# EasyEDA schematic Shield_Amir_EDO_V_0_2.json
TITLE: For EDO (DROP SCREEN exhibit, 3D exhebition); REV: 0.1; Date: 2023-12-05; Sheet: 1/1; Company: Amir BS
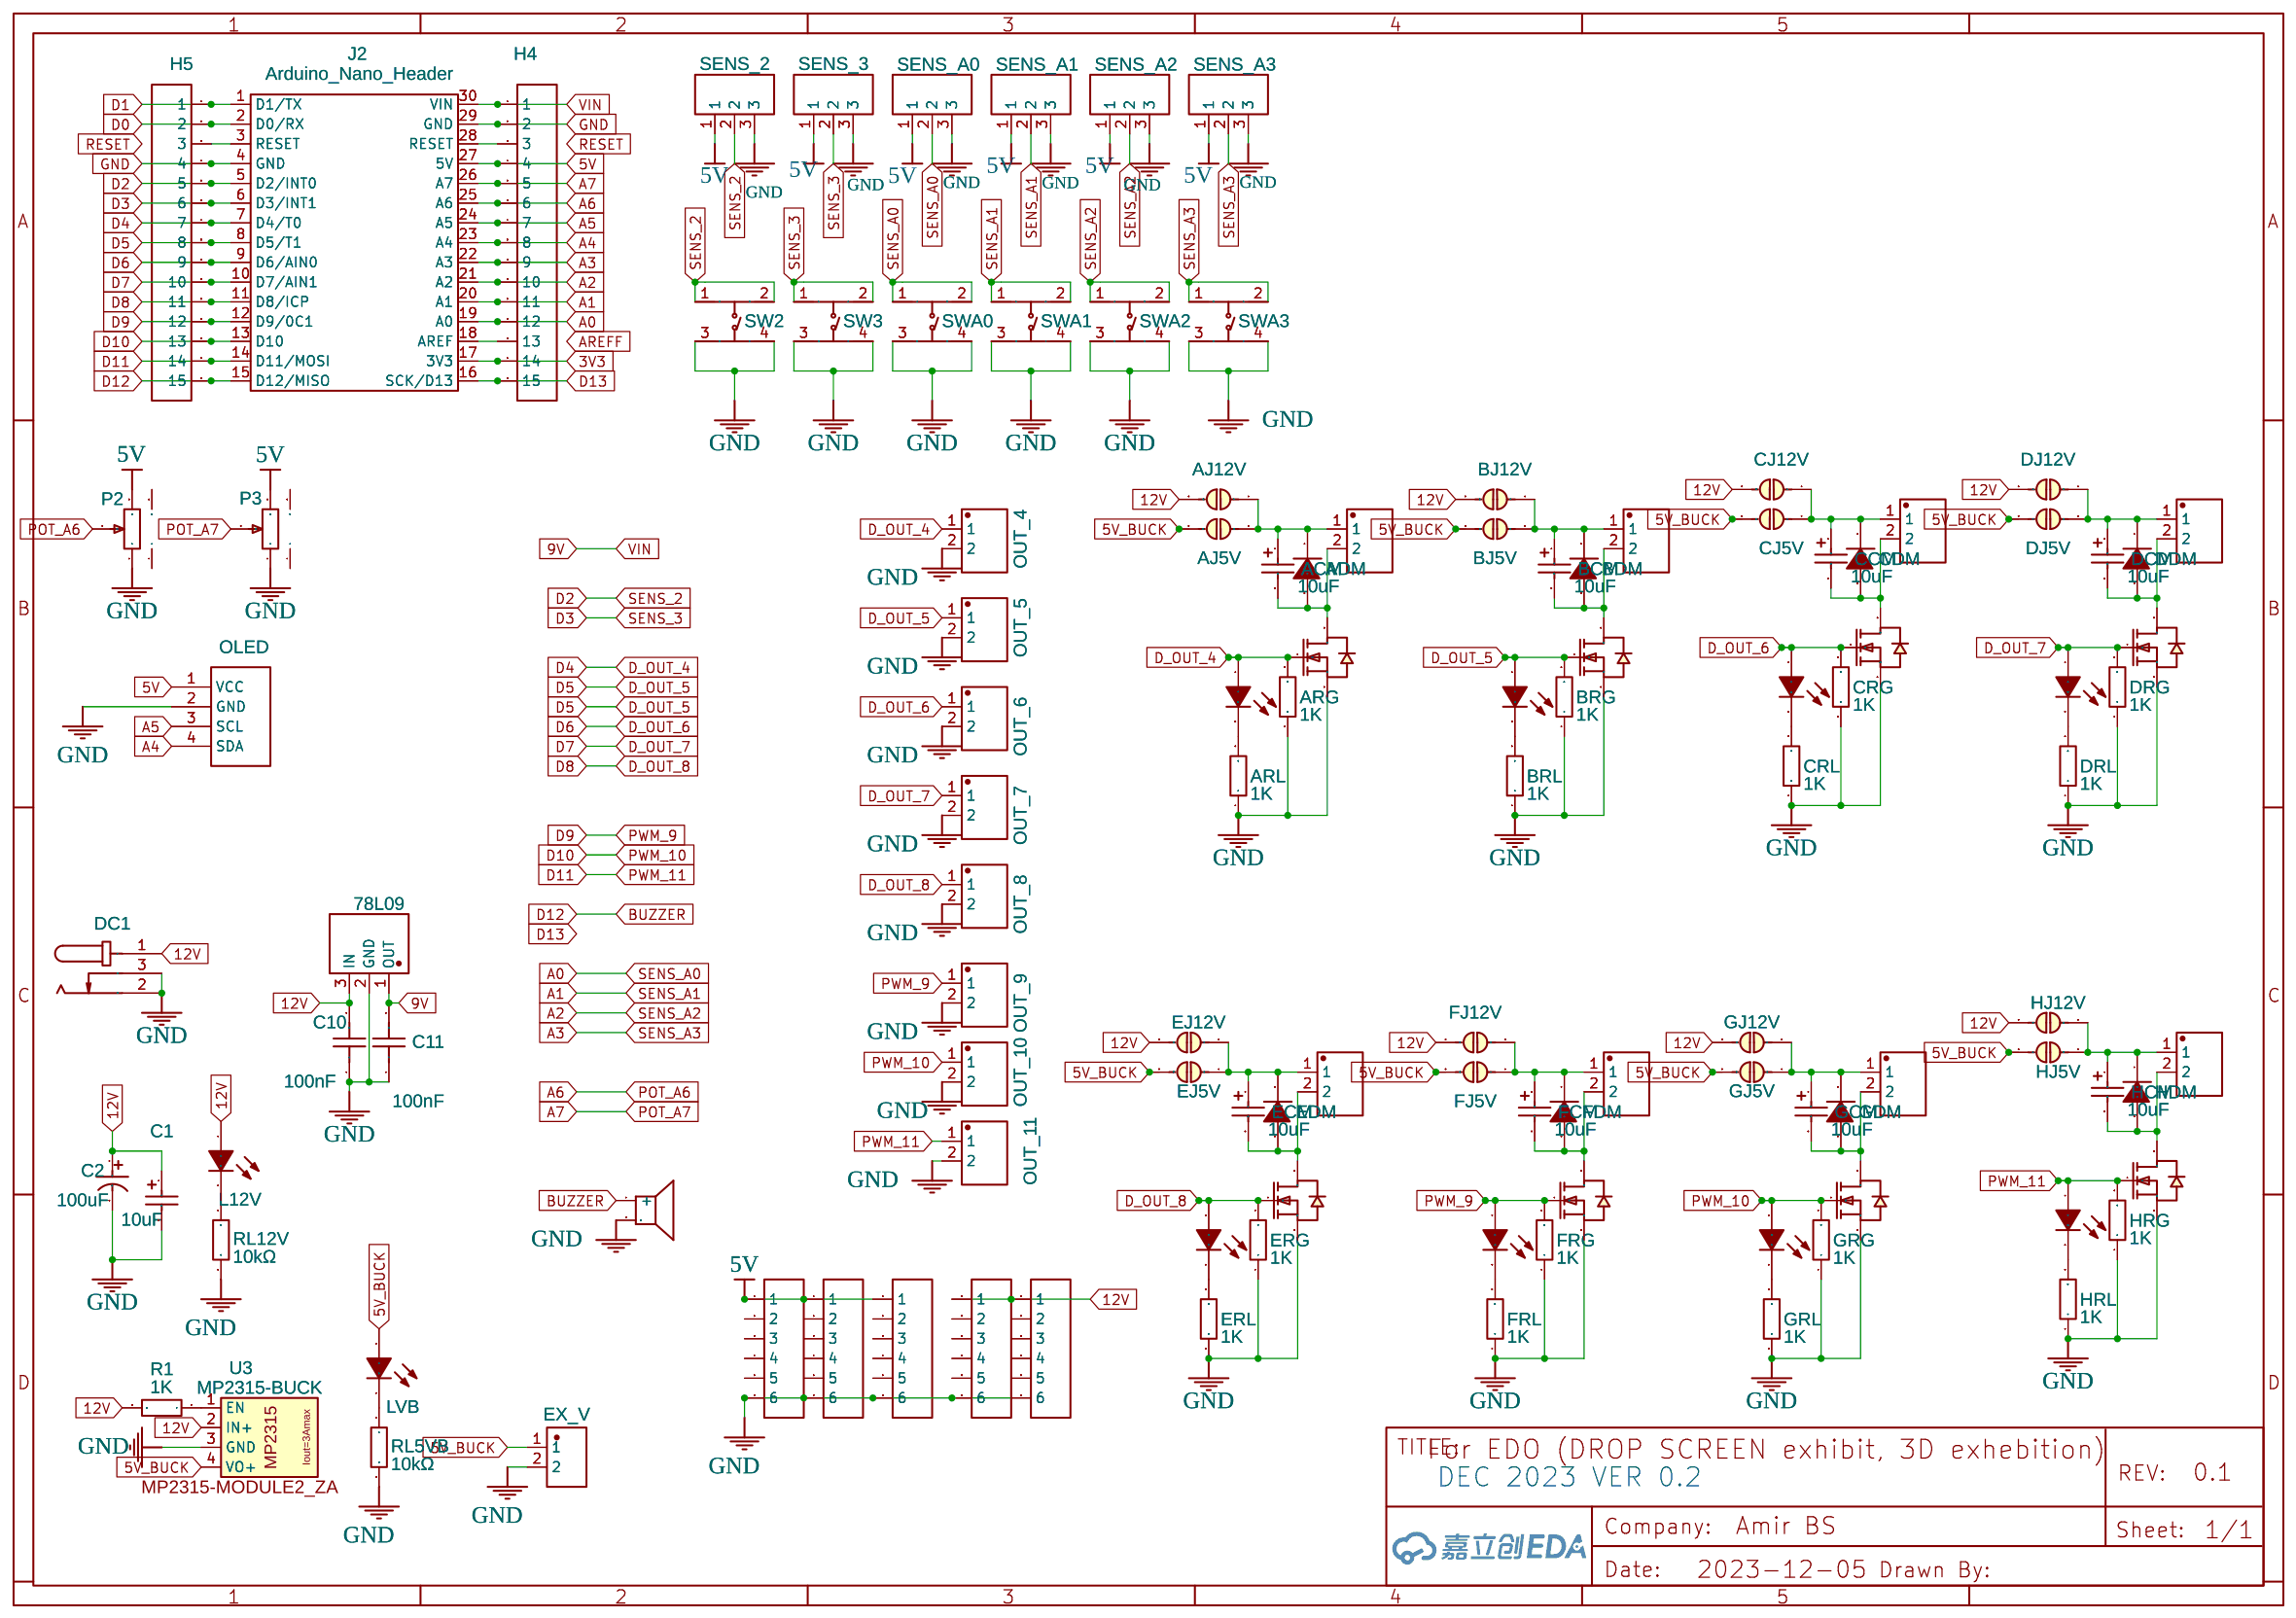
[diagram p0: schematic sheet]

## Parts
ACM  10uF  [CAP-SMD_L3.2-W1.6-RD-C7171]
ACON  KF2510-2A  [CONN-TH_KF2510-2A]
ADM  1N4007  [SMAF_L3.5-W2.6-LS4.7-RD]
AJ5V  JUMPER-SMT_2  [JUMPERS_SMT-JUMPER_2_NC_PASTE_NO-SILK]
AJ12V  JUMPER-SMT_2  [JUMPERS_SMT-JUMPER_2_NC_PASTE_NO-SILK]
ALD  LED  [LED0603-R-RD_BLUE]
AQ  Q  [SOT-23-3_L2.9-W1.3-P0.95-LS2.4-BR]
ARG  1K  [R0603]
ARL  1K  [R0603]
BCM  10uF  [CAP-SMD_L3.2-W1.6-RD-C7171]
BCON  KF2510-2A  [CONN-TH_KF2510-2A]
BDM  1N4007  [SMAF_L3.5-W2.6-LS4.7-RD]
BJ5V  JUMPER-SMT_2  [JUMPERS_SMT-JUMPER_2_NC_PASTE_NO-SILK]
BJ12V  JUMPER-SMT_2  [JUMPERS_SMT-JUMPER_2_NC_PASTE_NO-SILK]
BLD  LED  [LED0603-R-RD_BLUE]
BQ  Q  [SOT-23-3_L2.9-W1.3-P0.95-LS2.4-BR]
BRG  1K  [R0603]
BRL  1K  [R0603]
BUZZER1  BUZZER-12X9  [BUZ-TH_BD12.0-P7.60-D0.6-FD]
C1  10uF  [CAP-SMD_L3.2-W1.6-RD-C7171]
C2  100uF  [CAP-TH_BD6.3-P2.50-D1.0-FD]
C10  100nF  [C0603]
C11  100nF  [C0603]
CCM  10uF  [CAP-SMD_L3.2-W1.6-RD-C7171]
CCON  KF2510-2A  [CONN-TH_KF2510-2A]
CDM  1N4007  [SMAF_L3.5-W2.6-LS4.7-RD]
CJ5V  JUMPER-SMT_2  [JUMPERS_SMT-JUMPER_2_NC_PASTE_NO-SILK]
CJ12V  JUMPER-SMT_2  [JUMPERS_SMT-JUMPER_2_NC_PASTE_NO-SILK]
CLD  LED  [LED0603-R-RD_BLUE]
CQ  Q  [SOT-23-3_L2.9-W1.3-P0.95-LS2.4-BR]
CRG  1K  [R0603]
CRL  1K  [R0603]
DC1  DC  [DC-IN-TH_DC005]
DCM  10uF  [CAP-SMD_L3.2-W1.6-RD-C7171]
DCON  KF2510-2A  [CONN-TH_KF2510-2A]
DDM  1N4007  [SMAF_L3.5-W2.6-LS4.7-RD]
DJ5V  JUMPER-SMT_2  [JUMPERS_SMT-JUMPER_2_NC_PASTE_NO-SILK]
DJ12V  JUMPER-SMT_2  [JUMPERS_SMT-JUMPER_2_NC_PASTE_NO-SILK]
DLD  LED  [LED0603-R-RD_BLUE]
DQ  Q  [SOT-23-3_L2.9-W1.3-P0.95-LS2.4-BR]
DRG  1K  [R0603]
DRL  1K  [R0603]
ECM  10uF  [CAP-SMD_L3.2-W1.6-RD-C7171]
ECON  KF2510-2A  [CONN-TH_KF2510-2A]
EDM  1N4007  [SMAF_L3.5-W2.6-LS4.7-RD]
EJ5V  JUMPER-SMT_2  [JUMPERS_SMT-JUMPER_2_NC_PASTE_NO-SILK]
EJ12V  JUMPER-SMT_2  [JUMPERS_SMT-JUMPER_2_NC_PASTE_NO-SILK]
ELD  LED  [LED0603-R-RD_BLUE]
EQ  Q  [SOT-23-3_L2.9-W1.3-P0.95-LS2.4-BR]
ERG  1K  [R0603]
ERL  1K  [R0603]
EX_V  EX_V  [CONN-TH_2P-P5.00_L7.6-W10.0]
FCM  10uF  [CAP-SMD_L3.2-W1.6-RD-C7171]
FCON  KF2510-2A  [CONN-TH_KF2510-2A]
FDM  1N4007  [SMAF_L3.5-W2.6-LS4.7-RD]
FJ5V  JUMPER-SMT_2  [JUMPERS_SMT-JUMPER_2_NC_PASTE_NO-SILK]
FJ12V  JUMPER-SMT_2  [JUMPERS_SMT-JUMPER_2_NC_PASTE_NO-SILK]
FLD  LED  [LED0603-R-RD_BLUE]
FQ  Q  [SOT-23-3_L2.9-W1.3-P0.95-LS2.4-BR]
FRG  1K  [R0603]
FRL  1K  [R0603]
GCM  10uF  [CAP-SMD_L3.2-W1.6-RD-C7171]
GCON  KF2510-2A  [CONN-TH_KF2510-2A]
GDM  1N4007  [SMAF_L3.5-W2.6-LS4.7-RD]
GJ5V  JUMPER-SMT_2  [JUMPERS_SMT-JUMPER_2_NC_PASTE_NO-SILK]
GJ12V  JUMPER-SMT_2  [JUMPERS_SMT-JUMPER_2_NC_PASTE_NO-SILK]
GLD  LED  [LED0603-R-RD_BLUE]
GQ  Q  [SOT-23-3_L2.9-W1.3-P0.95-LS2.4-BR]
GRG  1K  [R0603]
GRL  1K  [R0603]
H1  HDR-F-2.54_1x6  [HDR-F-2.54_1X6]
H2  HDR-F-2.54_1x6  [HDR-F-2.54_1X6]
H3  HDR-F-2.54_1x6  [HDR-F-2.54_1X6]
H4  HDR-F-2.54_1x15  [HDR-F-2.54_1X15]
H5  HDR-F-2.54_1x15  [HDR-F-2.54_1X15]
H6  HDR-F-2.54_1x6  [HDR-F-2.54_1X6]
H11  HDR-F-2.54_1x6  [HDR-F-2.54_1X6]
HCM  10uF  [CAP-SMD_L3.2-W1.6-RD-C7171]
HCON  KF2510-2A  [CONN-TH_KF2510-2A]
HDM  1N4007  [SMAF_L3.5-W2.6-LS4.7-RD]
HJ5V  JUMPER-SMT_2  [JUMPERS_SMT-JUMPER_2_NC_PASTE_NO-SILK]
HJ12V  JUMPER-SMT_2  [JUMPERS_SMT-JUMPER_2_NC_PASTE_NO-SILK]
HLD  LED  [LED0603-R-RD_BLUE]
HQ  Q  [SOT-23-3_L2.9-W1.3-P0.95-LS2.4-BR]
HRG  1K  [R0603]
HRL  1K  [R0603]
J2  Arduino_Nano_Header  [DIP-30_L43.18-W15.24-ARDUINONANO]
L12V  LED  [LED0603-R-RD_BLUE]
LVB  LED  [LED0603-R-RD_BLUE]
OLED  1.3 inch OLED SSH1106 I2C 128x64 copy  [1.3_OLED_SSH1106_I2C_128X64_BOARD]
OUT_4  KF2510-2A  [CONN-TH_KF2510-2A]
OUT_5  KF2510-2A  [CONN-TH_KF2510-2A]
OUT_6  KF2510-2A  [CONN-TH_KF2510-2A]
OUT_7  KF2510-2A  [CONN-TH_KF2510-2A]
OUT_8  KF2510-2A  [CONN-TH_KF2510-2A]
OUT_9  KF2510-2A  [CONN-TH_KF2510-2A]
OUT_10  KF2510-2A  [CONN-TH_KF2510-2A]
OUT_11  KF2510-2A  [CONN-TH_KF2510-2A]
P2  长柄旋转电位器  [RES-ADJ-TH_RV09]
P3  长柄旋转电位器  [RES-ADJ-TH_RV09]
R1  1K  [R0603]
RL5VB  10kΩ  [R0603]
RL12V  10kΩ  [R0603]
SENS_2  FK2510  [CONN-TH_3P-P2.00_KF2510_3A]
SENS_3  FK2510  [CONN-TH_3P-P2.00_KF2510_3A]
SENS_A0  FK2510  [CONN-TH_3P-P2.00_KF2510_3A]
SENS_A1  FK2510  [CONN-TH_3P-P2.00_KF2510_3A]
SENS_A2  FK2510  [CONN-TH_3P-P2.00_KF2510_3A]
SENS_A3  FK2510  [CONN-TH_3P-P2.00_KF2510_3A]
SW2  TC-6610-7-160G  [SW-TH_4P-L5.0-W5.0-P4.50-LS6.5]
SW3  TC-6610-7-160G  [SW-TH_4P-L5.0-W5.0-P4.50-LS6.5]
SWA0  TC-6610-7-160G  [SW-TH_4P-L5.0-W5.0-P4.50-LS6.5]
SWA1  TC-6610-7-160G  [SW-TH_4P-L5.0-W5.0-P4.50-LS6.5]
SWA2  TC-6610-7-160G  [SW-TH_4P-L5.0-W5.0-P4.50-LS6.5]
SWA3  TC-6610-7-160G  [SW-TH_4P-L5.0-W5.0-P4.50-LS6.5]
U3  MP2315-BUCK  [MP2315-MODULE2_ZA]
U5  78L09  [SOT-89-3_L4.5-W2.5-P1.50-LS4.0-BR]

## Library data of the parts
ACM BCM CCM DCM ECM FCM GCM HCM = TAJA106K016RNJ: JLCPCB Part Class: Basic Part; Package Display: No
ACON BCON CCON DCON ECON FCON GCON HCON OUT_4-OUT_11 = KF2510-2A: Supplier: LCSC; Manufacturer: BOOMELE; Supplier Part: C27543; JLCPCB Part Class: Extended Part; Package Display: No
ADM BDM CDM DDM EDM FDM GDM HDM = 1N4007F: Supplier: LCSC; Manufacturer: SK; Supplier Part: C110856; JLCPCB Part Class: Extended Part; Package Display: No
AJ5V AJ12V BJ5V BJ12V CJ5V CJ12V DJ5V DJ12V EJ5V EJ12V FJ5V FJ12V GJ5V GJ12V HJ5V HJ12V = JUMPER-SMT_2: Contributor: P-Thomsen; Package Display: No
ALD BLD CLD DLD ELD FLD GLD HLD L12V LVB = 19-217/BHC-ZL1M2RY/3T: Supplier: LCSC; Manufacturer: EVERLIGHT; Supplier Part: C72041; JLCPCB Part Class: Basic Part; Package Display: No
AQ BQ CQ DQ EQ FQ GQ HQ = JSM2302: Supplier: LCSC; Supplier Part: C5224189; Manufacturer: ElecSuper(静芯微）; Manufacturer Part: AO3400; Contributor: LCSC; JLCPCB Part Class: Extended Part; Package Display: No
ARG ARL BRG BRL CRG CRL DRG DRL ERG ERL FRG FRL GRG GRL HRG HRL R1 = 0603WAF1001T5E: Supplier: LCSC; Manufacturer: UniOhm; Supplier Part: C21190; JLCPCB Part Class: Basic Part; Package Display: No
BUZZER1 = BUZZER-12X9: Contributor: lcsc; Supplier: LCSC; Supplier Part: C9900016920; Manufacturer: null; JLCPCB Part Class: Extended Part; Package Display: No
C1 = TAJA106K016RNJ: Supplier: LCSC; Manufacturer: Kyocera AVX; Supplier Part: C7171; JLCPCB Part Class: Basic Part; Package Display: No
C2 = 100uF 35V 6.3*11: Supplier: LCSC; Manufacturer: CX(承兴); Supplier Part: C19504; JLCPCB Part Class: Extended Part; Package Display: No
C10 C11 = CC0603KRX7R9BB104: JLCPCB Part Class: Basic Part; Package Display: No
DC1 = DC005-2.0MM: Supplier: LCSC; Manufacturer: SOFNG; Supplier Part: C111567; Package Display: No
EX_V = WJ306V-5.0-2P-14-00A: Contributor: lcsc; Supplier: LCSC; Supplier Part: C3031443; Manufacturer: KANGNEX(康奈克斯电气); JLCPCB Part Class: Extended Part; Package Display: No
H1-H3 H6 H11 = HDR-F-2.54_1x6: Supplier Part: C40877; Supplier: LCSC; Contributor: LCEDA_Lib; Package Display: No
H4 H5 = HDR-F-2.54_1x15: Supplier Part: C124408; Supplier: LCSC; Contributor: LCEDA_Lib; Package Display: No
J2 = Arduino_Nano_Header
OLED = 1.3 inch OLED SSH1106 I2C 128x64 copy: Contributor: Deguello; Package Display: No
P2 P3 = 长柄旋转电位器: Supplier: LCSC; Supplier Part: C2874842; Manufacturer: null; JLCPCB Part Class: Extended Part; Contributor: LCSC; Package Display: No
RL5VB RL12V = 0603WAF1002T5E: Supplier: LCSC; Manufacturer: UNI-ROYAL(厚声); Supplier Part: C25804; Resistance (Ohms): 10K; JLCPCB Part Class: Basic Part; Package Display: No
SENS_2 SENS_3 SENS_A0-SENS_A3 = kf2510_3A: JLCPCB Part Class: Extended Part; Package Display: No
SW2 SW3 SWA0-SWA3 = TC-6610-7-160G: Contributor: LCSC; Supplier: LCSC; Supplier Part: C2845252; Manufacturer: HCTL(华灿天禄); JLCPCB Part Class: Extended Part; Package Display: No
U3 = MP2315-BUCK: Supplier: FatimaTech; Contributor: zainul.aabdin; Package Display: Yes
U5 = 78L09U 78L09: Contributor: LCSC; Supplier: LCSC; Supplier Part: C2875177; Manufacturer: CBI(创基); JLCPCB Part Class: Extended Part; Package Display: No

## Nets
3V3: H4.14 J2.17(3V3)
5V: H1.1 H2.1 H3.1 H4.4 J2.27(5V) OLED.1(VCC) P2.3 P3.3 SENS_2.1 SENS_3.1 SENS_A0.1 SENS_A1.1 SENS_A2.1 SENS_A3.1
5V_BUCK: AJ5V.2 BJ5V.2 CJ5V.2 DJ5V.2 EJ5V.2 EX_V.1 FJ5V.2 GJ5V.2 HJ5V.2 LVB.1(A) U3.4(VO+)
9V: C11.2 H4.1 J2.30(VIN) U5.1(OUT)
12V: AJ12V.2 BJ12V.2 C1.1 C2.1 C10.2 CJ12V.2 DC1.1 DJ12V.2 EJ12V.2 FJ12V.2 GJ12V.2 H6.1 H11.1 HJ12V.2 L12V.1(A) R1.2 U3.2(IN+) U5.3(IN)
GND: AQ.2(S) ARG.1 ARL.1 BQ.2(S) BRG.1 BRL.1 BUZZER1.2 C1.2 C2.2 C10.1 C11.1 CQ.2(S) CRG.1 CRL.1 DC1.2 DC1.3 DQ.2(S) DRG.1 DRL.1 EQ.2(S) ERG.1 ERL.1 EX_V.2 FQ.2(S) FRG.1 FRL.1 GQ.2(S) GRG.1 GRL.1 H1.6 H2.6 H3.6 H4.2 H5.4 H6.6 H11.6 HQ.2(S) HRG.1 HRL.1 J2.4(GND) J2.29(GND) OLED.2(GND) OUT_4.2 OUT_5.2 OUT_6.2 OUT_7.2 OUT_8.2 OUT_9.2 OUT_10.2 OUT_11.2 P2.1 P3.1 RL5VB.2 RL12V.2 SENS_2.3 SENS_3.3 SENS_A0.3 SENS_A1.3 SENS_A2.3 SENS_A3.3 SW2.3 SW2.4 SW3.3 SW3.4 SWA0.3 SWA0.4 SWA1.3 SWA1.4 SWA2.3 SWA2.4 SWA3.3 SWA3.4 U3.3(GND) U5.2(GND)
A0: H4.12 J2.19(A0) SENS_A0.2 SWA0.1 SWA0.2
A1: H4.11 J2.20(A1) SENS_A1.2 SWA1.1 SWA1.2
A2: H4.10 J2.21(A2) SENS_A2.2 SWA2.1 SWA2.2
A3: H4.9 J2.22(A3) SENS_A3.2 SWA3.1 SWA3.2
A4: H4.8 J2.23(A4) OLED.4(SDA)
A5: H4.7 J2.24(A5) OLED.3(SCL)
A6: H4.6 J2.25(A6) P2.2
A7: H4.5 J2.26(A7) P3.2
BUZZER: BUZZER1.1(+) H5.15 J2.15(D12/MISO)
D0: H5.2 J2.2(D0/RX)
D1: H5.1 J2.1(D1/TX)
D2: H5.5 J2.5(D2/INT0) SENS_2.2 SW2.1 SW2.2
D3: H5.6 J2.6(D3/INT1) SENS_3.2 SW3.1 SW3.2
D4: ALD.1(A) AQ.1(G) ARG.2 H5.7 J2.7(D4/T0) OUT_4.1
D5: BLD.1(A) BQ.1(G) BRG.2 H5.8 J2.8(D5/T1) OUT_5.1
D6: CLD.1(A) CQ.1(G) CRG.2 H5.9 J2.9(D6/AIN0) OUT_6.1
D7: DLD.1(A) DQ.1(G) DRG.2 H5.10 J2.10(D7/AIN1) OUT_7.1
D8: ELD.1(A) EQ.1(G) ERG.2 H5.11 J2.11(D8/ICP) OUT_8.1
D9: FLD.1(A) FQ.1(G) FRG.2 H5.12 J2.12(D9/0C1) OUT_9.1
D10: GLD.1(A) GQ.1(G) GRG.2 H5.13 J2.13(D10) OUT_10.1
D11: H5.14 HLD.1(A) HQ.1(G) HRG.2 J2.14(D11/MOSI) OUT_11.1
D13: H4.15 J2.16(SCK/D13)
Net-(ACM-1): ACM.1 ACON.1 ADM.1(C) AJ5V.1 AJ12V.1
Net-(ACM-2): ACM.2 ACON.2 ADM.2(A) AQ.3(D)
Net-(ALD-2): ALD.2(C) ARL.2
Net-(BCM-1): BCM.1 BCON.1 BDM.1(C) BJ5V.1 BJ12V.1
Net-(BCM-2): BCM.2 BCON.2 BDM.2(A) BQ.3(D)
Net-(BLD-2): BLD.2(C) BRL.2
Net-(CCM-1): CCM.1 CCON.1 CDM.1(C) CJ5V.1 CJ12V.1
Net-(CCM-2): CCM.2 CCON.2 CDM.2(A) CQ.3(D)
Net-(CLD-2): CLD.2(C) CRL.2
Net-(DCM-1): DCM.1 DCON.1 DDM.1(C) DJ5V.1 DJ12V.1
Net-(DCM-2): DCM.2 DCON.2 DDM.2(A) DQ.3(D)
Net-(DLD-2): DLD.2(C) DRL.2
Net-(ECM-1): ECM.1 ECON.1 EDM.1(C) EJ5V.1 EJ12V.1
Net-(ECM-2): ECM.2 ECON.2 EDM.2(A) EQ.3(D)
Net-(ELD-2): ELD.2(C) ERL.2
Net-(FCM-1): FCM.1 FCON.1 FDM.1(C) FJ5V.1 FJ12V.1
Net-(FCM-2): FCM.2 FCON.2 FDM.2(A) FQ.3(D)
Net-(FLD-2): FLD.2(C) FRL.2
Net-(GCM-1): GCM.1 GCON.1 GDM.1(C) GJ5V.1 GJ12V.1
Net-(GCM-2): GCM.2 GCON.2 GDM.2(A) GQ.3(D)
Net-(GLD-2): GLD.2(C) GRL.2
Net-(H4-3): H4.3 J2.28(RESET)
Net-(H4-13): H4.13 J2.18(AREF)
Net-(H5-3): H5.3 J2.3(RESET)
Net-(HCM-1): HCM.1 HCON.1 HDM.1(C) HJ5V.1 HJ12V.1
Net-(HCM-2): HCM.2 HCON.2 HDM.2(A) HQ.3(D)
Net-(HLD-2): HLD.2(C) HRL.2
Net-(L12V-2): L12V.2(C) RL12V.1
Net-(LVB-2): LVB.2(C) RL5VB.1
Net-(R1-1): R1.1 U3.1(EN)

Not connected (* = marked no-connect by the designer): H1 2 3 4 5; H2 2 3 4 5; H3 2 3 4 5; H6 2 3 4 5; H11 2 3 4 5; P2 4 5; P3 4 5

## Notes on the sheet
- DEC 2023 VER 0.2
